# EAGLE design item_2022_Motherboard_02_V7 (EAGLE 7.7.0)

## Sheet 1 of 2
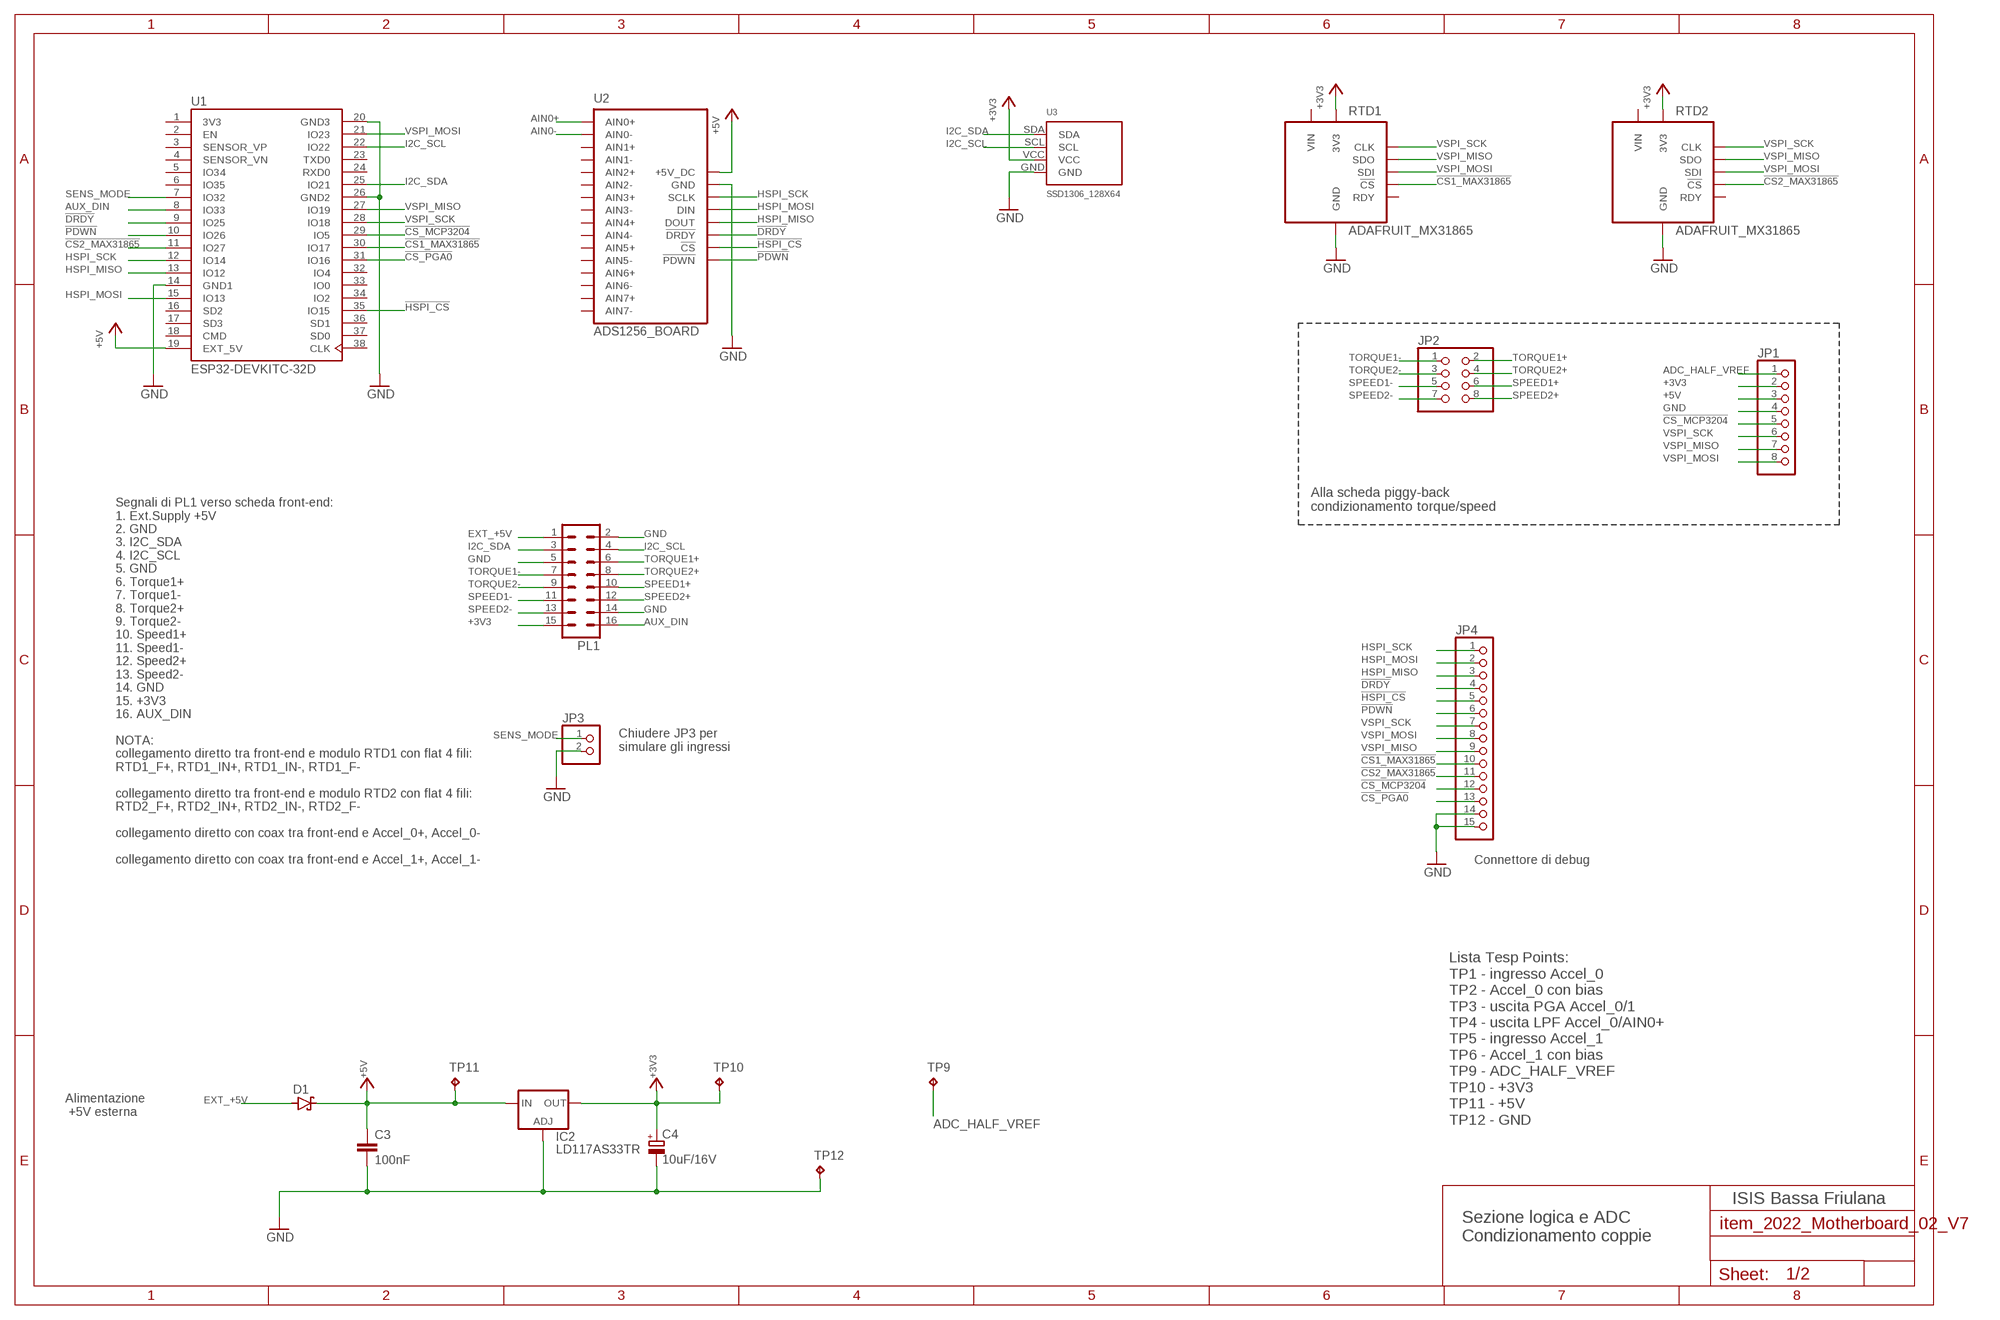
[diagram p0: schematic, sheet 1]

### Parts
C3  100nF  C-EUC0805K  [C0805K]
C4  10uF/16V  CPOL-EUE3.5-8  [E3,5-8]
D1  SCHOTTKY-DIODEDO35-7  [DO35-7]
IC2  LD117AS33TR  [SOT223]
JP1  PINHD-1X8  [1X08]
JP2  PINHD-2X4  [2X04]
JP3  PINHD-1X2  [1X02]
JP4  PINHD-1X15  [1X15]
PL1  16V  [16V]
RTD1  ADAFRUIT_MX31865  [ADAFRUIT_MAX31865]
RTD2  ADAFRUIT_MX31865  [ADAFRUIT_MAX31865]
TP9  TPTP16SQ  [TP16SQ]
TP10  TPTP16SQ  [TP16SQ]
TP11  TPTP16SQ  [TP16SQ]
TP12  TPTP14R  [TP14R]
U1  ESP32-DEVKITC-32D  [MODULE_ESP32-DEVKITC-32D]
U2  ADS1256_BOARD  [ADS1256_BOARD]
U3  SSD1306_128X64  [128X64]

### Nets
!CS1_MAX31865! [digital]: JP4.10 RTD1.P7(!CS!) U1.30(IO17)
!CS2_MAX31865! [digital]: JP4.11 RTD2.P7(!CS!) U1.11(IO27)
!CS_MCP3204! [digital]: JP1.5 JP4.12 U1.29(IO5)
!CS_PGA0! [digital]: JP4.13 U1.31(IO16) ; also sheet 2
!DRDY! [digital]: JP4.4 U1.9(IO25) U2.!DRDY!
!HSPI_CS! [digital]: JP4.5 U1.35(IO15) U2.!CS!
!PDWN! [digital]: JP4.6 U1.10(IO26) U2.PDWN(!PDWN!)
+3V3 [supply]: C4.+ IC2.4(OUT) JP1.2 PL1.15 RTD1.P3(3V3) RTD2.P3(3V3) TP10.TP U3.VCC
+5V [supply]: C3.1 D1.C IC2.3(IN) JP1.3 TP11.TP U1.19(EXT_5V) U2.5V_DC(+5V_DC) ; also sheet 2
ADC_HALF_VREF [supply]: JP1.1 TP9.TP ; also sheet 2
AIN0+ [analog]: U2.AIN0+ ; also sheet 2
AIN0- [analog]: U2.AIN0- ; also sheet 2
AUX_DIN [digital]: PL1.16 U1.8(IO33)
EXT_+5V [supply]: D1.A PL1.1
GND [supply]: C3.2 C4.- IC2.1(ADJ) JP1.4 JP3.2 JP4.14 JP4.15 PL1.2 PL1.5 PL1.14 RTD1.P2(GND) RTD2.P2(GND) TP12.TP U1.14(GND1) U1.20(GND3) U1.26(GND2) U2.GND U3.GND ; also sheet 2
HSPI_MISO [digital]: JP4.3 U1.13(IO12) U2.DOUT
HSPI_MOSI [digital]: JP4.2 U1.15(IO13) U2.DIN
HSPI_SCK [digital]: JP4.1 U1.12(IO14) U2.SCLK
I2C_SCL [digital]: PL1.4 U1.22(IO22) U3.SCL
I2C_SDA [digital]: PL1.3 U1.25(IO21) U3.SDA
SENS_MODE [digital]: JP3.1 U1.7(IO32)
SPEED1+ [analog]: JP2.6 PL1.10
SPEED1- [supply]: JP2.5 PL1.11
SPEED2+ [analog]: JP2.8 PL1.12
SPEED2- [supply]: JP2.7 PL1.13
TORQUE1+ [analog]: JP2.2 PL1.6
TORQUE1- [supply]: JP2.1 PL1.7
TORQUE2+ [analog]: JP2.4 PL1.8
TORQUE2- [supply]: JP2.3 PL1.9
VSPI_MISO [digital]: JP1.7 JP4.9 RTD1.P5(SDO) RTD2.P5(SDO) U1.27(IO19)
VSPI_MOSI [digital]: JP1.8 JP4.8 RTD1.P6(SDI) RTD2.P6(SDI) U1.21(IO23) ; also sheet 2
VSPI_SCK [digital]: JP1.6 JP4.7 RTD1.P4(CLK) RTD2.P4(CLK) U1.28(IO18) ; also sheet 2
Unconnected: RTD1.P8(RDY) RTD2.P8(RDY) U1.2(EN) U1.3(SENSOR_VP) U1.4(SENSOR_VN) U1.5(IO34) U1.6(IO35) U1.16(SD2) U1.17(SD3) U1.18(CMD) U1.23(TXD0) U1.24(RXD0) U1.32(IO4) U1.33(IO0) U1.34(IO2) U1.36(SD1) U1.37(SD0) U1.38(CLK) U2.AIN1+ U2.AIN1- U2.AIN2+ U2.AIN2- U2.AIN3+ U2.AIN3- U2.AIN4+ U2.AIN4- U2.AIN5+ U2.AIN5- U2.AIN6+ U2.AIN6- U2.AIN7+ U2.AIN7-

### Notes on the sheet
- Alla scheda piggy-back
  condizionamento torque/speed
- Chiudere JP3 per
  simulare gli ingressi
- Connettore di debug
- Segnali di PL1 verso scheda front-end:
  1. Ext.Supply +5V
  2. GND
  3. I2C_SDA
  4. I2C_SCL
  5. GND
  6. Torque1+
  7. Torque1-
  8. Torque2+
  9. Torque2-
  10. Speed1+
  11. Speed1-
  12. Speed2+
  13. Speed2-
  14. GND
  15. +3V3
  16. AUX_DIN
  
  NOTA:
  collegamento diretto tra front-end e modulo RTD1 con flat 4 fili:
  RTD1_F+, RTD1_IN+, RTD1_IN-, RTD1_F-
  
  collegamento diretto tra front-end e modulo RTD2 con flat 4 fili:
  RTD2_F+, RTD2_IN+, RTD2_IN-, RTD2_F-
  
  collegamento diretto con coax tra front-end e Accel_0+, Accel_0-
  
  collegamento diretto con coax tra front-end e Accel_1+, Accel_1-
- Alimentazione
   +5V esterna
- Lista Tesp Points:
  TP1 - ingresso Accel_0
  TP2 - Accel_0 con bias
  TP3 - uscita PGA Accel_0/1
  TP4 - uscita LPF Accel_0/AIN0+
  TP5 - ingresso Accel_1
  TP6 - Accel_1 con bias
  TP9 - ADC_HALF_VREF
  TP10 - +3V3
  TP11 - +5V
  TP12 - GND
- ISIS Bassa Friulana
- Sezione logica e ADC
  Condizionamento coppie

## Sheet 2 of 2
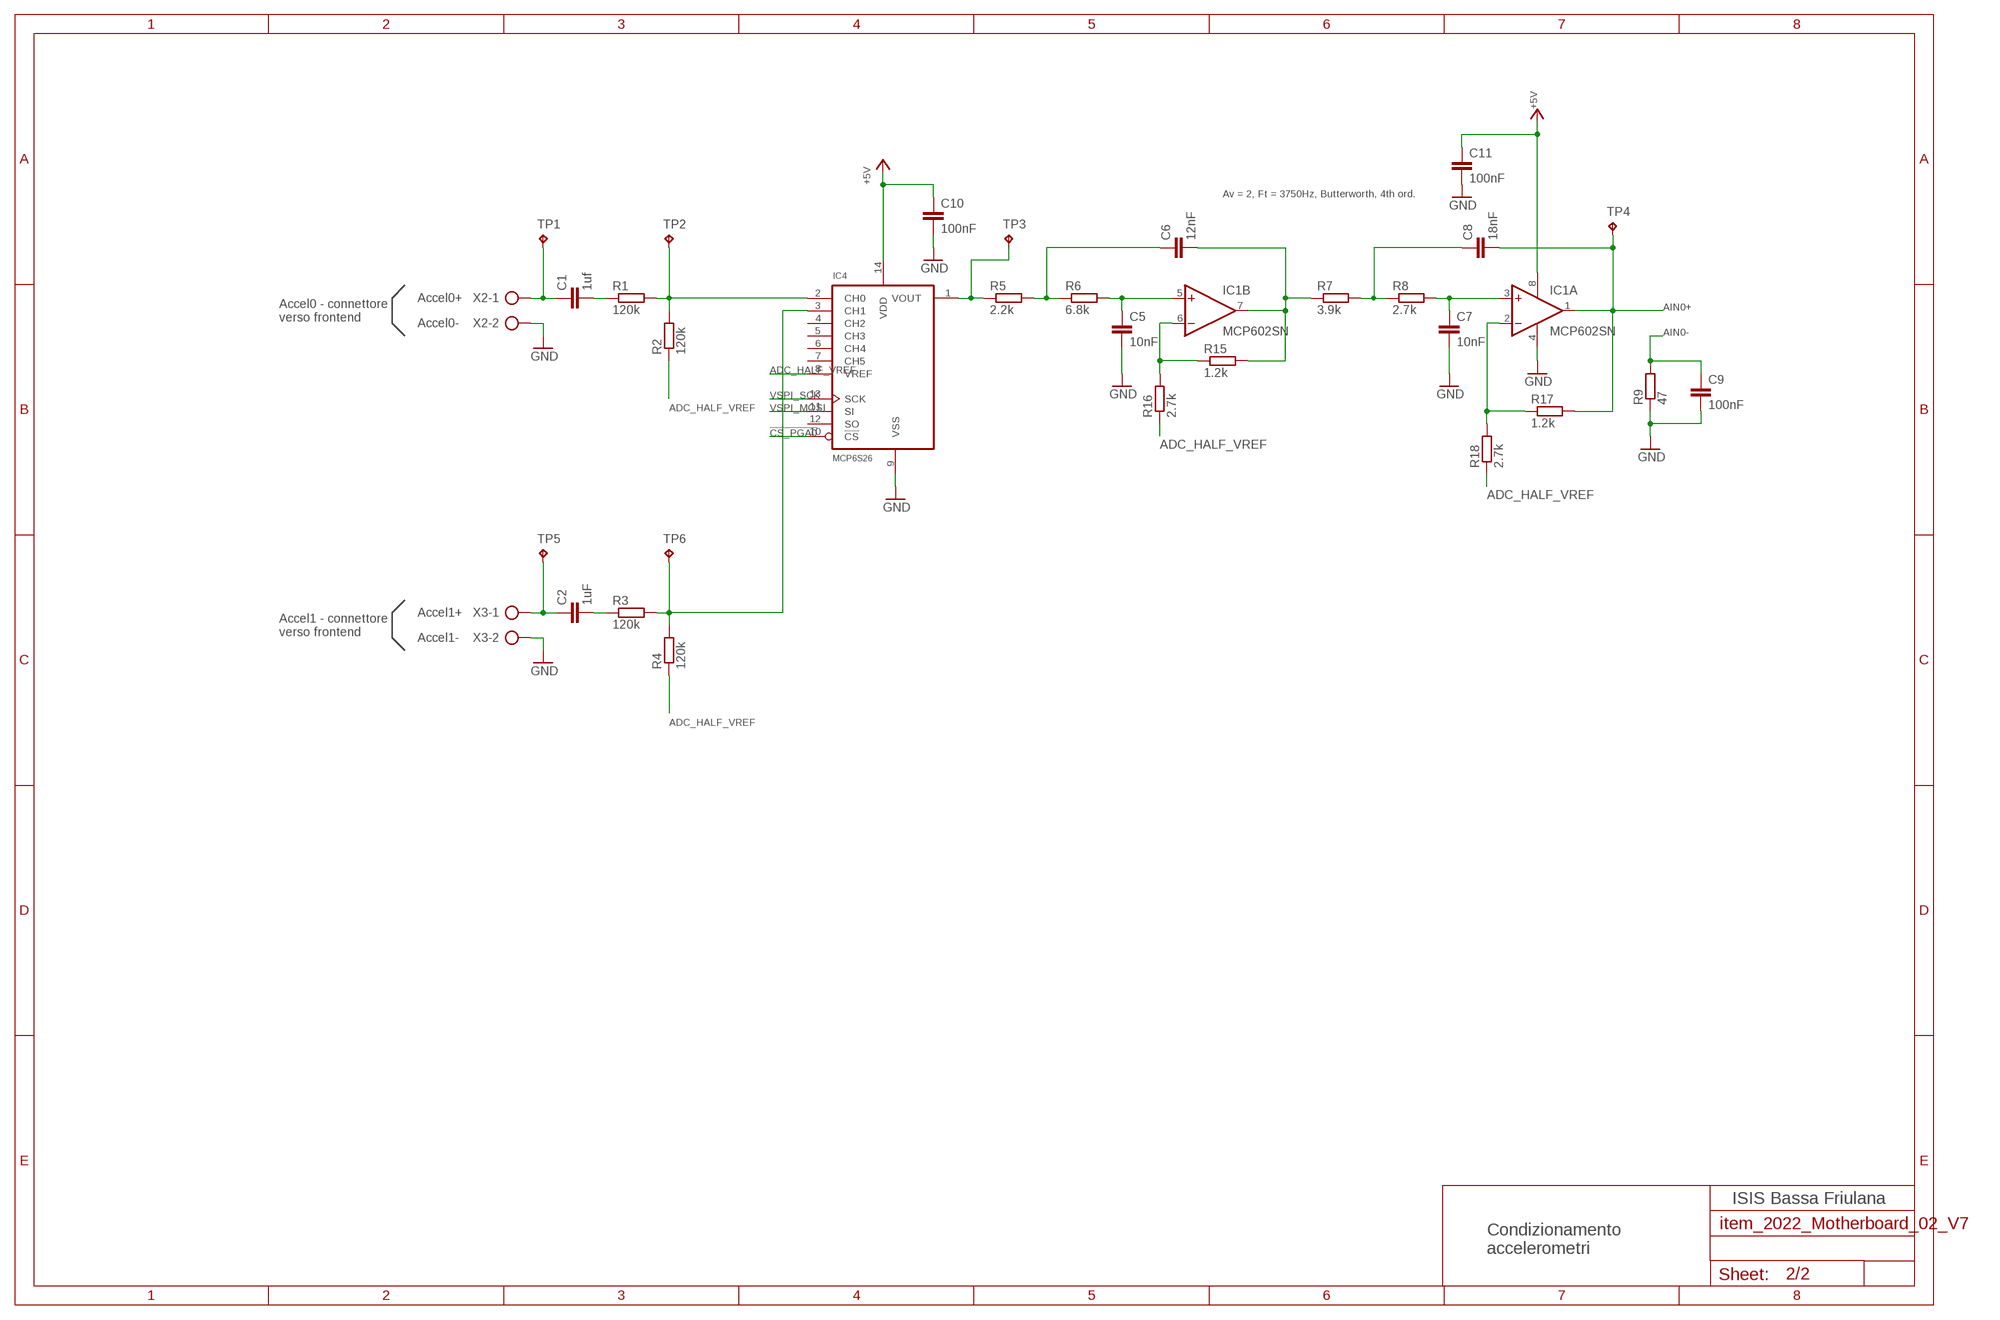
[diagram p1: schematic, sheet 2]

### Parts
C1  1uf  C-EUC1206  [C1206]
C2  1uF  C-EUC1206  [C1206]
C5  10nF  C-EUC0805K  [C0805K]
C6  12nF  C-EUC0805K  [C0805K]
C7  10nF  C-EUC0805K  [C0805K]
C8  18nF  C-EUC0805K  [C0805K]
C9  100nF  C-EUC0805K  [C0805K]
C10  100nF  C-EUC0805K  [C0805K]
C11  100nF  C-EUC0805K  [C0805K]
IC1  MCP602SN  [SO08]
IC4  MCP6S26  [SO14]
R1  120k  R-EU_R0805  [R0805]
R2  120k  R-EU_R0805  [R0805]
R3  120k  R-EU_R0805  [R0805]
R4  120k  R-EU_R0805  [R0805]
R5  2.2k  R-EU_R0805  [R0805]
R6  6.8k  R-EU_R0805  [R0805]
R7  3.9k  R-EU_R0805  [R0805]
R8  2.7k  R-EU_R0805  [R0805]
R9  47  R-EU_R0805  [R0805]
R15  1.2k  R-EU_R0805  [R0805]
R16  2.7k  R-EU_R0805  [R0805]
R17  1.2k  R-EU_R0805  [R0805]
R18  2.7k  R-EU_R0805  [R0805]
TP1  TPTP14R  [TP14R]
TP2  TPTP14R  [TP14R]
TP3  TPTP14R  [TP14R]
TP4  TPTP14R  [TP14R]
TP5  TPTP14R  [TP14R]
TP6  TPTP14R  [TP14R]
X2  AK500/2  [AK500/2]
X3  AK500/2  [AK500/2]

### Nets
!CS_PGA0! [digital]: IC4.10(!CS!) ; also sheet 1
+5V [supply]: C10.1 C11.1 IC1.8(P:V+) IC4.14(VDD) ; also sheet 1
ADC_HALF_VREF [supply]: IC4.8(VREF) R2.1 R4.1 R16.1 R18.1 ; also sheet 1
AIN0+ [analog]: C8.2 IC1.1(A:OUT) R17.2 TP4.TP ; also sheet 1
AIN0- [analog]: C9.1 R9.2 ; also sheet 1
GND [supply]: C5.2 C7.2 C9.2 C10.2 IC1.4(P:V-) IC4.9(VSS) R9.1 X2.2 X3.2 ; also sheet 1
N$2 [analog]: C1.1 TP1.TP X2.1
N$3 [analog]: C2.1 TP5.TP X3.1
N$4 [analog]: IC4.2(CH0) R1.2 R2.2 TP2.TP
N$5 [analog]: IC4.1(VOUT) R5.1 TP3.TP
N$6 [analog]: C1.2 R1.1
N$7: C2.2 R3.1
N$8 [analog]: IC1.6(B:-IN) R15.1 R16.2
N$9 [analog]: C6.1 R5.2 R6.1
N$10 [analog]: C5.1 IC1.5(B:+IN) R6.2
N$11 [analog]: C6.2 IC1.7(B:OUT) R7.1 R15.2
N$12 [analog]: C8.1 R7.2 R8.1
N$13 [analog]: C7.1 IC1.3(A:+IN) R8.2
N$14 [analog]: IC4.3(CH1) R3.2 R4.2 TP6.TP
N$21 [analog]: IC1.2(A:-IN) R17.1 R18.2
VSPI_MOSI [digital]: IC4.11(SI) ; also sheet 1
VSPI_SCK [digital]: IC4.13(SCK) ; also sheet 1
Unconnected: C11.2 IC4.4(CH2) IC4.5(CH3) IC4.6(CH4) IC4.7(CH5) IC4.12(SO)

### Notes on the sheet
- Av = 2, Ft = 3750Hz, Butterworth, 4th ord.
- Accel0+
- Accel0 - connettore 
  verso frontend
- Accel0-
- Accel1+
- Accel1 - connettore 
  verso frontend
- Accel1-
- ISIS Bassa Friulana
- Condizionamento
  accelerometri

## Power pins joined to a net without a drawn wire
3V3: U1.1(3V3)
VIN: RTD1.P1(VIN) RTD2.P1(VIN)

## Library data of the parts
C1-C3 C5-C11 = rcl:C-EU: CAPACITOR, European symbol; SPICEPREFIX: C
C4 = rcl@1:CPOL-EU: POLARIZED CAPACITOR, European symbol
D1 = diode:SCHOTTKY-DIODE: Schottky Diode
IC1 = linear:MCP602: Single Op Amp 2.7V to 6.0V Single Supply CMOS Source: http://ww1.microchip.com/downloads/en/DeviceDoc/21314g.pdf
IC2 = v-reg:LD117A?*: Low drop fixed and adjustable positive voltage regulators 1 A Source: http://www.st.com/stonline/products/literature/ds/7194/ld1117axx.pdf
IC4 = microchip_opamp:MCP6S26: MCP6S26 Six channels analog Programmable Gain Amplifier with SPI interface
JP1 = pinhead:PINHD-1X8: PIN HEADER
JP2 = pinhead:PINHD-2X4: PIN HEADER
JP3 = pinhead:PINHD-1X2: PIN HEADER
JP4 = pinhead:PINHD-1X15: PIN HEADER
PL1 = con-harting-v:16V: CONNECTOR; OC_FARNELL: unknown; OC_NEWARK: unknown
R1-R9 R15-R18 = rcl:R-EU_: RESISTOR, European symbol; SPICEPREFIX: R
RTD1 RTD2 = Adafruit_MAX31865_RTD:ADAFRUIT_MX31865: Adafruit MAX31865 - Adafruit MAX31865 RTD PT100 or PT1000 Amplifier
TP1-TP6 TP9-TP12 = testpad:TP: Test pad
U1 = ESP32-DEVKITC-32D:ESP32-DEVKITC-32D: Eval Board For Esp-Wroom-32 Check prices <https://pricing.snapeda.com/parts/ESP32-DEVKITC-32D/Espressif%20Systems/view-part?ref=eda>; AVAILABILITY: Warning; DESCRIPTION: WiFi Development Tools (802.11) ESP32 General Development Kit, ESP32-WROOM-32D on the board; MF: Espressif Systems; MP: ESP32-DEVKITC-32D; PACKAGE: None; PRICE: None; PURCHASE-URL: https://pricing.snapeda.com/search/part/ESP32-DEVKITC-32D/?ref=eda
U2 = ADS1256:ADS1256_BOARD: Board 8 Channels - ADS1256 24bit
U3 = ssd1306oled:SSD1306_128X64: OLED Display Board 0.91" 128x64 White I2C - 4 Pins - SSD1306
X2 X3 = con-ptr500:AK500/2: CONNECTOR; OC_FARNELL: unknown; OC_NEWARK: unknown

## Net classes
1 supply: width 0.762 mm, drill 0.508 mm, clearance 0.406 mm to class 0, clearance 0.406 mm
2 digital: width 0.305 mm, drill 0.305 mm, clearance 0.305 mm to class 0, clearance 0.305 mm to class 1, clearance 0.305 mm
3 analog: width 0.508 mm, drill 0.508 mm, clearance 0.406 mm to class 0, clearance 0.406 mm to class 1, clearance 0.406 mm to class 2, clearance 0.406 mm

## Board
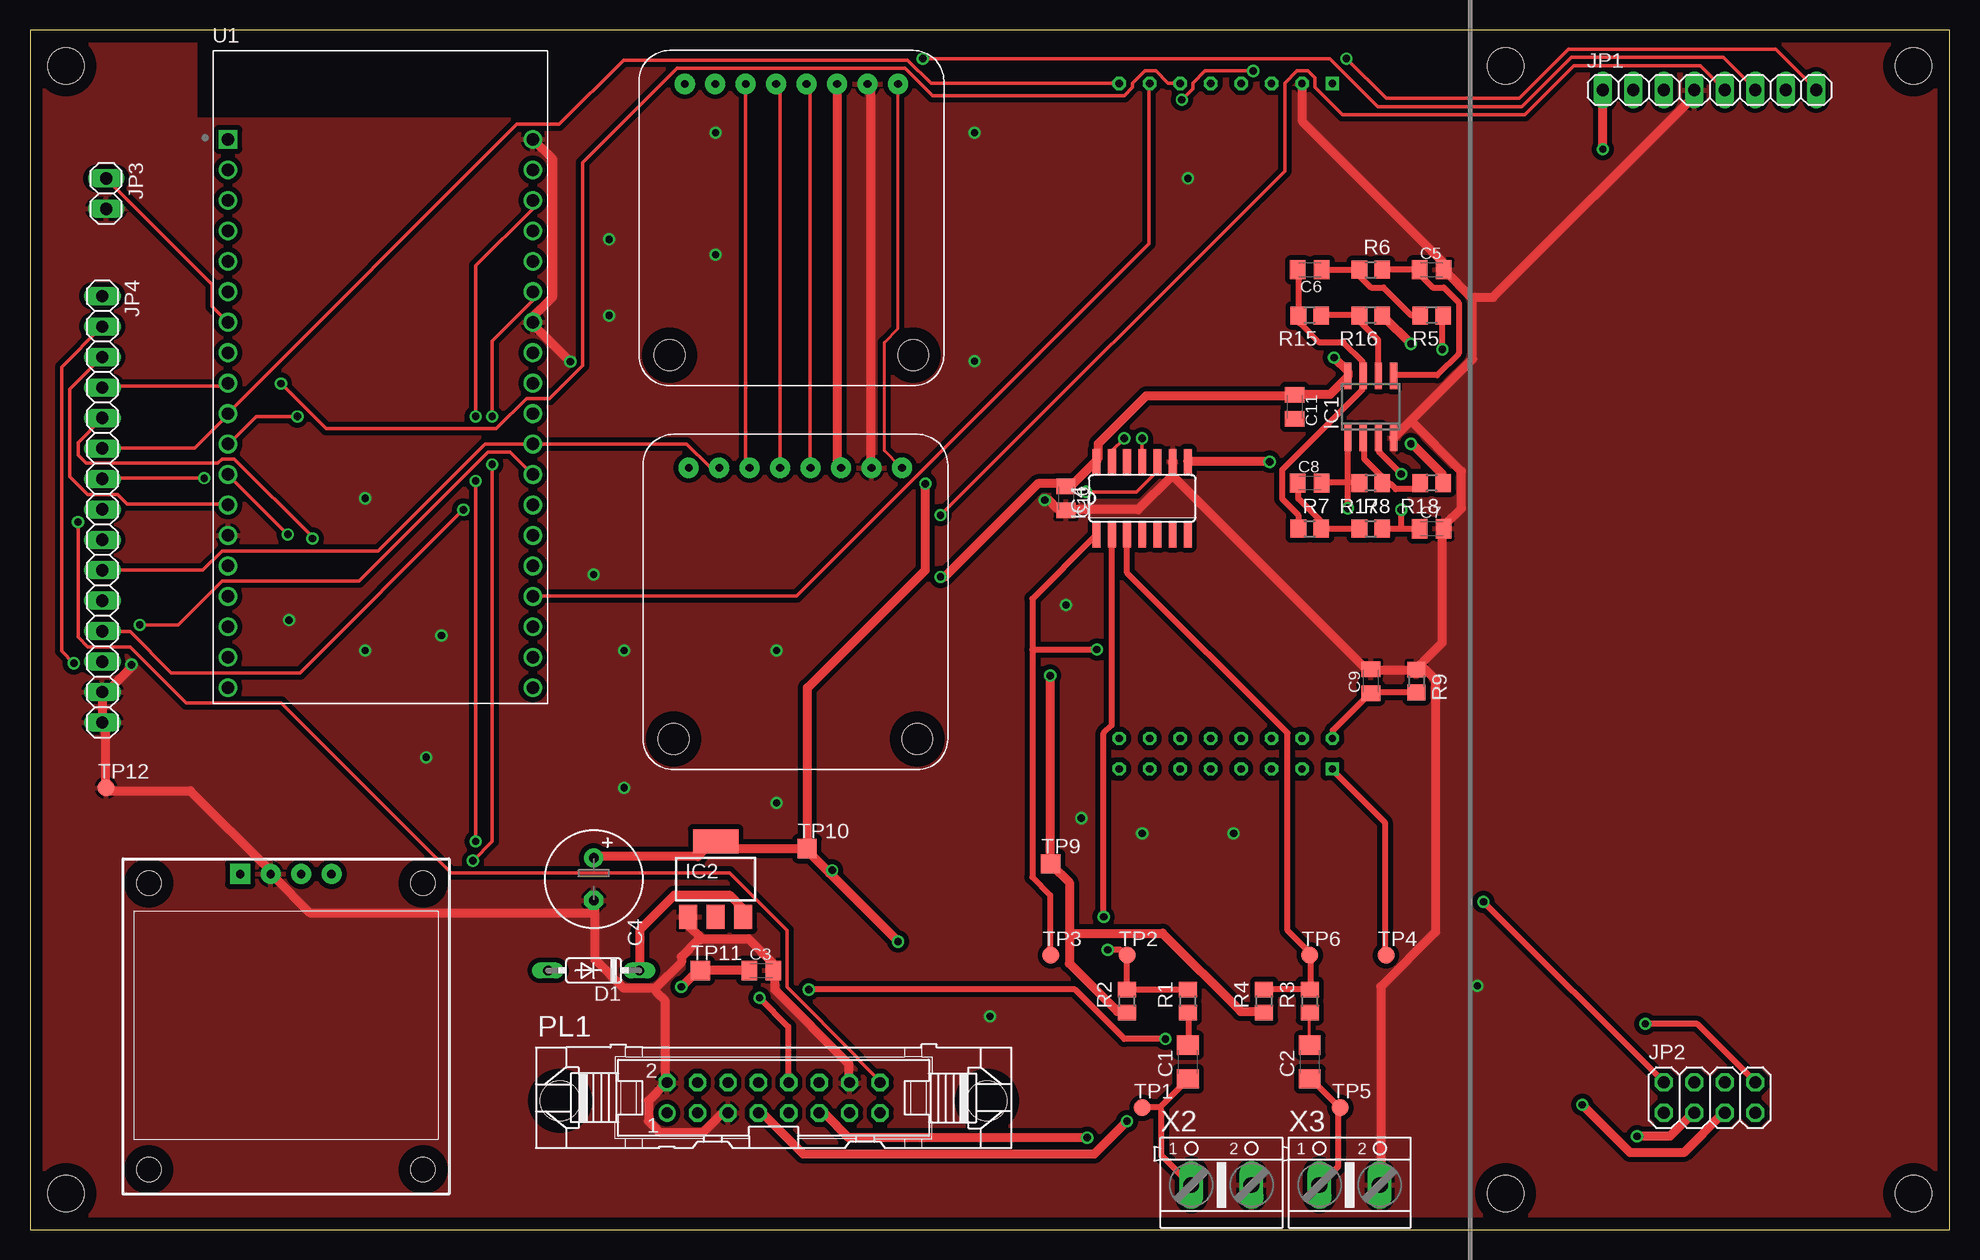
[diagram p2: board, top side]
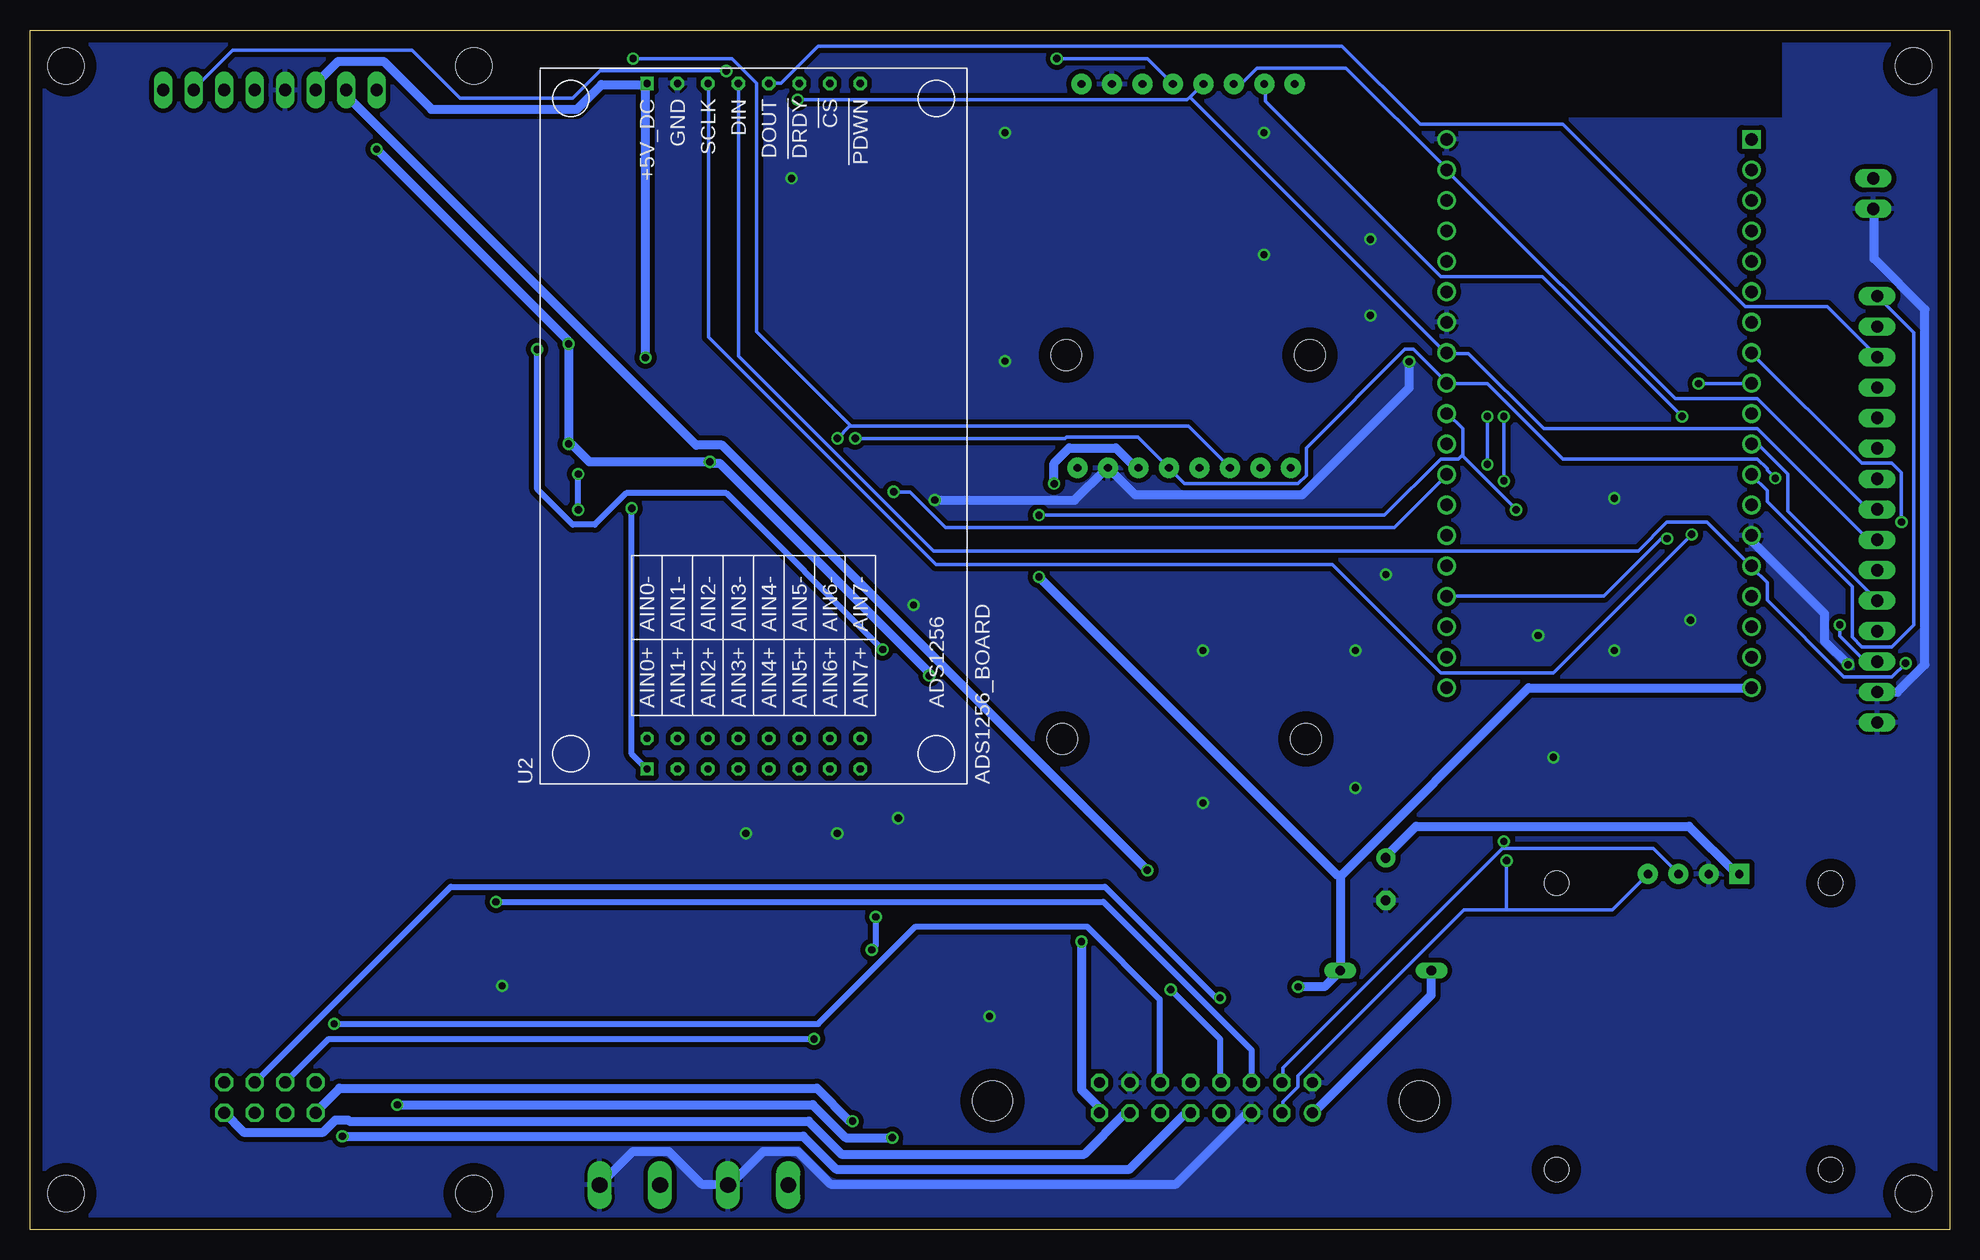
[diagram p3: board, bottom side, seen from below]

Size 160 x 100 mm. Coordinates in mm from the lower left corner, seen from the top.
Outline: 0,0 160,0 160,100 0,100 0,0
Copper layers (1*16): Top 0.035mm / dielectric 1.5mm / Bottom 0.035mm
Design rules "default": minimum track width 10mil, minimum drill 24mil, track to track 8mil, track to pad 8mil, pad to pad 8mil, via to via 8mil, smd to smd 8mil, copper to edge 40mil, drill to drill 8mil, minimum pad ring 10mil, minimum via ring 8mil, stop-mask expansion 4mil, vias tented up to drill 0mil, thermal gap 10mil
Holes 3 mm at 157,97 157,3 123,97 123,3 3,97 3,3
tRestrict: area 14,92.7 to 44.5,100.3
bRestrict: area 14,92.7 to 44.5,100.3

### Footprints (pad centres in the part's own frame; a part is rotated, then mirrored left to right if it is on the bottom)
C1206 = smd 1.6 x 1.8: 1 -1.4,0; 2 1.4,0
C0805K = smd 1.3 x 1.6: 1 -1,0; 2 1,0
E3,5-8 = drill 0.813 pad 1.6: + -1.778,0 | drill 0.813 pad 1.6 octagon: - 1.778,0
DO35-7 = drill 0.813 long: A 3.81,0; C -3.81,0
SO08 = smd 0.6 x 2.2: 1 -1.905,-2.6; 2 -0.635,-2.6; 3 0.635,-2.6; 4 1.905,-2.6; 5 1.905,2.6; 6 0.635,2.6; 7 -0.635,2.6; 8 -1.905,2.6
SOT223 = smd 1.5 x 2: 1 -2.3,-3.15; 2 0,-3.15; 3 2.3,-3.15 | smd 3.8 x 2: 4 0,3.15
SO14 = smd 0.66 x 2.032: 1 -3.81,-3.073; 2 -2.54,-3.073; 3 -1.27,-3.073; 4 0,-3.073; 5 1.27,-3.073; 6 2.54,-3.073; 7 3.81,-3.073; 8 3.81,3.073; 9 2.54,3.073; 10 1.27,3.073; 11 0,3.073; 12 -1.27,3.073; 13 -2.54,3.073; 14 -3.81,3.073
1X08 = drill 1.016 long: 1 -8.89,0; 2 -6.35,0; 3 -3.81,0; 4 -1.27,0; 5 1.27,0; 6 3.81,0; 7 6.35,0; 8 8.89,0
2X04 = drill 1.016 octagon: 1 -3.81,-1.27; 2 -3.81,1.27; 3 -1.27,-1.27; 4 -1.27,1.27; 5 1.27,-1.27; 6 1.27,1.27; 7 3.81,-1.27; 8 3.81,1.27
1X02 = drill 1.016 long: 1 -1.27,0; 2 1.27,0
1X15 = drill 1.016 long: 1 -17.78,0; 2 -15.24,0; 3 -12.7,0; 4 -10.16,0; 5 -7.62,0; 6 -5.08,0; 7 -2.54,0; 8 0,0; 9 2.54,0; 10 5.08,0; 11 7.62,0; 12 10.16,0; 13 12.7,0; 14 15.24,0; 15 17.78,0
16V = drill 0.914: 1 -8.89,-1.27 | drill 0.914 octagon: 2 -8.89,1.27; 3 -6.35,-1.27; 4 -6.35,1.27; 5 -3.81,-1.27; 6 -3.81,1.27; 7 -1.27,-1.27; 8 -1.27,1.27; 9 1.27,-1.27; 10 1.27,1.27; 11 3.81,-1.27; 12 3.81,1.27; 13 6.35,-1.27; 14 6.35,1.27; 15 8.89,-1.27; 16 8.89,1.27 | hole 3.302: 17.78,-0.254; -17.78,-0.254
R0805 = smd 1.3 x 1.5: 1 -0.95,0; 2 0.95,0
ADAFRUIT_MAX31865 = drill 0.65 pad 1.676: P1 -8.89,-10.16; P2 -6.35,-10.16; P3 -3.81,-10.16; P4 -1.27,-10.16; P5 1.27,-10.16; P6 3.81,-10.16; P7 6.35,-10.16; P8 8.89,-10.16 | hole 2.54: -10.16,12.446; 10.16,12.446
TP14R = smd 1.4 x 1.4: TP 0,0
TP16SQ = smd 1.6 x 1.6: TP 0,0
MODULE_ESP32-DEVKITC-32D = drill 1.04 square: 1 -12.7,19.76 | drill 1.04: 2 -12.7,17.22; 3 -12.7,14.68; 4 -12.7,12.14; 5 -12.7,9.6; 6 -12.7,7.06; 7 -12.7,4.52; 8 -12.7,1.98; 9 -12.7,-0.56; 10 -12.7,-3.1; 11 -12.7,-5.64; 12 -12.7,-8.18; 13 -12.7,-10.72; 14 -12.7,-13.26; 15 -12.7,-15.8; 16 -12.7,-18.34; 17 -12.7,-20.88; 18 -12.7,-23.42; 19 -12.7,-25.96; 20 12.7,19.76; 21 12.7,17.22; 22 12.7,14.68; 23 12.7,12.14; 24 12.7,9.6; 25 12.7,7.06; 26 12.7,4.52; 27 12.7,1.98; 28 12.7,-0.56; 29 12.7,-3.1; 30 12.7,-5.64; 31 12.7,-8.18; 32 12.7,-10.72; 33 12.7,-13.26; 34 12.7,-15.8; 35 12.7,-18.34; 36 12.7,-20.88; 37 12.7,-23.42; 38 12.7,-25.96
ADS1256_BOARD = drill 0.6 square: 5V_DC 27.94,7.62; AIN0+ -29.21,7.62 | drill 0.6 octagon: !CS! 27.94,-7.62; !DRDY! 27.94,-5.08; AIN0- -26.67,7.62; AIN1+ -29.21,5.08; AIN1- -26.67,5.08; AIN2+ -29.21,2.54; AIN2- -26.67,2.54; AIN3+ -29.21,0; AIN3- -26.67,0; AIN4+ -29.21,-2.54; AIN4- -26.67,-2.54; AIN5+ -29.21,-5.08; AIN5- -26.67,-5.08; AIN6+ -29.21,-7.62; AIN6- -26.67,-7.62; AIN7+ -29.21,-10.16; AIN7- -26.67,-10.16; DIN 27.94,0; DOUT 27.94,-2.54; GND 27.94,5.08; PDWN 27.94,-10.16; SCLK 27.94,2.54
128X64 = drill 0.7 pad 1.676: GND -1.27,12.7; SCL 1.27,12.7; SDA 3.81,12.7 | drill 0.7 pad 1.676 square: VCC -3.81,12.7 | hole 2.032: -11.43,11.938; -11.43,-11.938; 11.43,11.938; 11.43,-11.938
AK500/2 = drill 1.321 long: 1 -2.515,0; 2 2.515,0

### Placement (x,y rotation side)
C1  96.52,13.97 90 top
C2  106.68,13.97 90 top
C3  60.96,21.59 0 top
C4  46.99,29.21 270 top
C5  116.84,80.01 0 top
C6  106.68,80.01 180 top
C7  116.84,58.42 0 top
C8  106.68,62.23 0 top
C9  111.76,45.72 90 top
C10  86.36,60.96 270 top
C11  105.41,68.58 270 top
D1  46.99,21.59 180 top
IC1  111.76,68.58 0 top
IC2  57.15,29.21 0 top
IC4  92.71,60.96 0 top
JP1  140,95 0 top
JP2  140,11 0 top
JP3  6.35,86.36 270 top
JP4  6.03,60.04 270 top
PL1  61.98,10.98 0 top
R1  96.52,19.05 90 top
R2  91.44,19.05 90 top
R3  106.68,19.05 90 top
R4  102.87,19.05 90 top
R5  116.84,76.2 180 top
R6  111.76,80.01 0 top
R7  106.68,58.42 0 top
R8  111.76,58.42 0 top
R9  115.57,45.72 270 top
R15  106.68,76.2 180 top
R16  111.76,76.2 180 top
R17  111.76,62.23 180 top
R18  116.84,62.23 180 top
RTD1  63.8,53.34 180 top
RTD2  63.47,85.34 180 top
TP1  92.71,10.16 0 top
TP2  91.44,22.86 0 top
TP3  85.09,22.86 0 top
TP4  113.03,22.86 0 top
TP5  109.22,10.16 0 top
TP6  106.68,22.86 0 top
TP9  85.09,30.48 0 top
TP10  64.77,31.75 0 top
TP11  55.88,21.59 0 top
TP12  6.35,36.83 0 top
U1  29.21,71.12 0 top
U2  100.95,67.61 90 bottom
U3  21.33,16.93 0 top
X2  99.31,3.71 0 top
X3  110,3.71 0 top

### Tracks (layer width: path | path; a pad name or v marks a point on that pad's centre or on a via)
!CS1_MAX31865!
  Top 0.305: JP4.10 6.06,54.98 14.4,54.98 16,56.58 29.03,56.58 37.95,65.49 41.83,65.49 U1.30 42.06,65.49 54.75,65.49 56.69,63.55 57.38,63.55 RTD1.P7
!CS2_MAX31865!  (via drill 0.61)
  Top 0.305: v22.29,67.78 18.86,67.78 16.57,65.49 U1.11
  Bottom 0.305: JP4.11 6.06,52.46 13.49,59.89 13.49,62.98 15.89,65.38 16.46,65.38 U1.11 | v22.29,67.78 33.95,79.44 42.41,79.44 57.04,94.07 57.04,95.44 RTD2.P7
!CS_MCP3204!  (via drill 0.61)
  Top 0.305: v36.12,60.01 22.52,46.41 11.77,46.41 8.34,49.84 6.06,49.84 JP4.12 | v75.89,59.55 104.58,88.24 104.58,95.56 105.61,96.58 106.53,96.58 107.1,96.01 107.1,95.21 109.39,92.93 124.59,92.93 128.7,97.04 139.22,97.04 141.16,95.1 JP1.5
  Bottom 0.305: 40.58,64.47 v36.12,60.01 | 40.58,64.47 40.58,66.75 41.83,68.01 U1.29 | v75.89,59.55 47.09,59.55 42.41,64.24 40.92,64.24 40.69,64.47 40.58,64.47
!CS_PGA0!  (via drill 0.61)
  Top 0.305: v88.01,61.49 92.24,61.49 93.95,63.21 93.95,64.01 IC4.10 | v9.14,50.41 12.34,50.41 16,54.06 27.43,54.06 38.18,64.81 40.01,64.81 41.83,62.98 U1.31
  Bottom 0.305: v88.01,61.49 86.64,61.49 83.67,58.52 46.29,58.52 41.95,62.87 U1.31 | v9.14,50.41 9.14,49.49 7.09,47.43 6.06,47.43 JP4.13
!DRDY!  (via drill 0.61)
  Top 0.305: v20.92,70.52 24.69,66.75 38.86,66.75 41.38,69.27 43.32,69.27 46.06,72.01 46.06,88.92 53.95,96.81 72.92,96.81 75.21,94.53 91.21,94.53 91.9,95.21 91.9,95.56 92.93,96.58 93.84,96.58 94.87,95.56 95.78,95.56 U2.!DRDY! | JP4.4 6.06,70.29 16.23,70.29 16.46,70.52 U1.9
  Bottom 0.305: v20.92,70.52 16.57,70.52 U1.9
!HSPI_CS!  (via drill 0.61)
  Top 0.305: U2.!CS! 93.27,95.44 93.27,82.18 63.89,52.81 41.95,52.81 U1.35 | v23.55,57.61 23.55,57.72 17.03,64.24 16,64.24 15.66,63.89 4.69,63.89 4,64.58 4,65.61 5.94,67.55 JP4.5
  Bottom 0.305: v23.55,57.61 24,57.61 28.8,52.81 41.83,52.81 U1.35
!PDWN!
  Top 0.305: U2.PDWN 90.75,95.56 75.09,95.56 73.15,97.5 49.49,97.5 44.12,92.13 40.58,92.13 16.57,68.12 U1.10 16.46,67.89 13.72,65.15 6.06,65.15 JP4.6
+3V3  (via drill 0.61)
  Top 0.762: RTD2.P3 67.32,95.44 67.32,63.78 67.55,63.55 RTD1.P3 | TP10.TP 64.69,31.77 57.72,31.77 57.15,32.35 IC2.4 56.81,32.23 55.66,31.09 47.09,31.09 C4.+ | 66.64,29.72 64.92,31.43 TP10.TP | 66.64,29.72 v72.35,24 | v66.86,29.95 66.64,29.72 | v74.64,62.18 74.64,54.98 64.81,45.15 64.81,32.12 TP10.TP
  Bottom 0.762: v72.35,24 72.35,11.66 70.98,10.29 70.98,9.72 PL1.15 | v66.86,29.95 102.3,65.38 104.47,65.38 133.62,94.53 133.62,94.98 JP1.2 | U3.VCC 17.6,29.72 17.83,29.72 21.72,33.6 44.46,33.6 46.98,31.09 C4.+ | v74.64,62.18 74.64,63.89 73.38,65.15 69.49,65.15 67.89,63.55 67.67,63.55 RTD1.P3
+5V  (via drill 0.61)
  Top 0.762: C3.1 59.89,21.6 55.89,21.6 TP11.TP 55.55,21.49 v54.29,20.23 | IC2.3 59.44,26.06 59.44,26.75 58.29,27.89 53.72,27.89 50.86,25.03 50.86,21.6 D1.C | v108.7,72.69 109.84,71.55 IC1.8 109.84,71.09 108.36,69.61 105.5,69.61 C11.1 105.04,69.49 93.04,69.49 89.04,65.49 89.04,64.35 IC4.14 88.81,64.01 86.87,62.06 86.41,62.06 C10.1 86.07,62.18 84.01,62.18 76.24,54.41 v75.89,54.41
  Bottom 0.762: v54.29,20.23 52.12,20.23 50.86,21.49 D1.C 50.75,21.95 50.75,29.49 | 50.75,29.49 35.09,45.15 16.57,45.15 U1.19 | JP1.3 136.13,95.1 136.13,95.56 134.3,97.38 130.53,97.38 126.53,93.38 114.41,93.38 112.36,95.44 108.58,95.44 U2.5V_DC 108.7,95.1 v108.7,72.69 | v75.89,54.41 51.09,29.6 50.75,29.49
ADC_HALF_VREF  (via drill 0.61)
  Top 0.762: 86.64,24.69 86.64,28.92 85.15,30.4 TP9.TP 85.04,30.86 v85.04,46.18 | 86.64,24.69 86.64,22.17 90.64,18.17 91.44,18.17 R2.1 | 86.64,24.69 94.41,24.69 100.93,18.17 102.87,18.17 R4.1 | v115.1,65.49 115.21,65.49 117.73,62.98 117.73,62.29 R18.1 | v115.1,73.84 112.81,76.12 R16.1 | v103.33,64.01 96.58,64.01 IC4.8 | v131.1,90.07 131.1,94.98 JP1.1
  Bottom 0.762: v131.1,90.07 115.21,74.18 v115.1,73.84 v115.1,65.49 114.76,65.38 113.39,64.01 v103.33,64.01 102.98,63.89 102.53,63.89 85.04,46.41 v85.04,46.18
AIN0+  (via drill 0.61)
  Top 0.508: 109.84,62.29 107.78,62.29 C8.2 | 109.84,62.29 110.76,62.29 R17.2 | 109.84,62.29 109.84,65.95 IC1.1 | TP4.TP 112.93,22.86 112.93,33.95 108.58,38.29 U2.AIN0+ | v109.84,60.12 109.84,62.29
  Bottom 0.508: v109.84,60.12 109.84,39.66 108.58,38.41 U2.AIN0+
AIN0-
  Top 0.508: R9.2 115.56,44.81 111.78,44.81 C9.1 111.56,44.58 108.58,41.6 108.58,41.03 U2.AIN0-
AUX_DIN  (via drill 0.61)
  Top 0.305: v4,58.98 4,49.38 4.8,48.58 8.34,48.58 13.03,43.89 20.92,43.89 35.09,29.72 58.29,29.72 63.09,24.92 63.09,20.23 69.04,14.29 69.04,14.17 70.87,12.34 PL1.16
  Bottom 0.305: v4,58.98 4,63.09 4.8,63.89 7.32,63.89 16.46,73.04 U1.8
EXT_+5V
  Bottom 0.762: D1.A 43.2,21.49 43.2,19.55 53.03,9.72 PL1.1
GND  (via drill 0.6, 0.61)
  Top 0.762: PL1.5 58.06,9.6 57.61,9.6 56.12,8.12 52.46,8.12 51.55,9.03 51.55,10.74 53.03,12.23 PL1.2 52.92,12.57 52.92,19.09 52.23,19.77 52.12,20.12 | 56.01,24.23 59.89,24.23 61.95,22.17 61.95,21.6 C3.2 62.06,21.26 62.06,20 68.24,13.83 68.24,12.34 PL1.14 | 56.01,24.23 54.86,25.38 54.86,25.95 IC2.1 | 47.09,26.4 47.09,22.52 49.49,20.12 52.12,20.12 | 47.09,26.4 47.09,27.43 C4.- | 52.12,20.12 54.29,22.29 54.29,22.75 55.66,24.12 56.01,24.23 | v8.46,47.09 8.46,46.86 6.4,44.81 JP4.14 6.06,44.69 6.06,42.63 JP4.15 6.06,42.18 6.29,41.95 6.29,36.92 TP12.TP 6.63,36.58 13.37,36.58 20,29.95 20,29.72 U3.GND 20.34,29.38 23.32,26.4 47.09,26.4 | U1.20 41.95,90.87 43.55,89.27 43.55,77.72 41.95,76.12 41.95,75.67 U1.26 42.06,75.32 v45.03,72.35 | RTD1.P2 70.07,63.55 70.07,95.21 69.84,95.44 RTD2.P2 | 120.24,77.61 C5.2 117.73,80.35 117.73,80.7 106.07,92.35 106.07,95.44 U2.GND | 120.24,77.61 120.24,72.58 115.1,67.44 | 115.1,67.44 113.73,66.06 IC1.4 | JP1.4 138.65,94.98 138.65,94.41 121.96,77.72 120.59,77.72 120.24,77.61 | 95.21,62.87 92.35,60.01 86.41,60.01 C10.2 86.07,60.12 85.61,60.12 84.92,60.81 v84.58,60.81 | 95.21,62.87 95.21,64.01 IC4.9 | R9.1 115.56,46.63 111.78,46.63 C9.2 111.44,46.63 95.21,62.87 | R9.1 115.79,46.98 117.73,48.92 117.73,58.41 C7.2 117.96,58.75 119.33,60.12 119.33,63.21 115.1,67.44 | X3.2 112.58,3.77 112.58,20.23 117.16,24.8 117.16,45.83 116.13,46.86 R9.1
  Bottom 0.762: JP3.2 6.29,85.04 6.29,80.92 2.06,76.69 2.06,47.09 4.34,44.81 5.94,44.81 JP4.14 | v8.46,47.09 10.4,49.03 10.4,51.32 16.46,57.38 16.46,57.84 U1.14 | v45.03,72.35 45.03,70.18 53.95,61.27 67.89,61.27 70.07,63.44 RTD1.P2 70.41,63.32 72.92,60.81 v84.58,60.81 | X3.2 112.47,3.77 109.73,6.51 106.76,6.51 104.01,3.77 101.84,3.77 X2.2 101.5,3.89 98.87,6.51 96.01,6.51 93.27,3.77 64.47,3.77 58.64,9.6 58.18,9.6 PL1.5
  other vias: 48.26,82.55 57.15,91.44 48.26,76.2 57.15,81.28 78.74,91.44 78.74,72.39 96.52,87.63 27.94,60.96 46.99,54.61 62.23,35.56 33.02,39.37 100.33,33.02 92.71,33.02 86.36,52.07 87.63,34.29 27.94,48.26 34.29,49.53 49.53,36.83 49.53,48.26 62.23,48.26 21.59,50.8 80.01,17.78 120.65,20.32
  pour Top: -1.27,101.6 161.29,101.6 161.29,-2.54 -1.27,-2.54
  pour Bottom: -1.27,101.6 161.29,101.6 161.29,-1.27 -1.27,-1.27
HSPI_MISO
  Top 0.305: U1.13 16.46,60.47 8.12,60.47 7.32,61.27 4.8,61.27 3.31,62.75 3.31,70.07 5.94,72.69 JP4.3
  Bottom 0.305: U2.DOUT 98.3,95.56 97.38,95.56 94.3,98.64 50.63,98.64 44.12,92.13 32.23,92.13 17.03,76.92 10.17,76.92 6.06,72.81 JP4.3
HSPI_MOSI  (via drill 0.61)
  Top 0.305: v3.66,47.21 2.63,48.23 2.63,71.89 5.94,75.21 JP4.2
  Bottom 0.305: U2.DIN 100.93,95.44 100.93,72.81 84.7,56.58 25.95,56.58 23.55,58.98 20.23,58.98 16.57,55.32 U1.15 16.46,55.21 15.2,53.95 15.2,52.46 8.8,46.06 4.8,46.06 v3.66,47.21
HSPI_SCK  (via drill 0.61)
  Top 0.305: v21.49,57.95 16.57,62.87 U1.12
  Bottom 0.305: v21.49,57.95 33.03,46.41 42.41,46.41 51.44,55.44 84.47,55.44 103.44,74.41 103.44,95.44 U2.SCLK | JP4.1 5.94,77.72 2.97,74.75 2.97,50.41 4.8,48.58 7.32,48.58 8.12,49.38 8.12,53.61 15.2,60.69 15.2,61.61 16.46,62.87 U1.12
I2C_SCL  (via drill 0.61)
  Top 0.305: v37.15,67.78 37.15,80.35 41.83,85.04 41.83,85.72 U1.22 | v37.15,32.35 v37.15,62.41
  Bottom 0.305: 37.15,31.77 24.69,31.77 22.63,29.72 U3.SCL | 37.15,31.77 37.26,31.77 55.55,13.49 55.55,12.34 PL1.4 | v37.15,62.41 v37.15,67.78 | 37.15,31.77 v37.15,32.35
I2C_SDA  (via drill 0.61)
  Top 0.305: v38.52,67.78 38.52,74.07 41.83,77.38 41.83,78.07 U1.25 | v38.52,63.78 38.52,32.35 v36.92,30.75
  Bottom 0.305: 36.92,26.63 28.12,26.63 25.15,29.6 U3.SDA | 36.92,26.63 40.46,26.63 54.29,12.8 54.29,11.89 55.55,10.63 55.55,9.72 PL1.3 | v38.52,63.78 v38.52,67.78 | 36.92,26.63 v36.92,30.75
N$2
  Top 0.508: 94.18,10.17 92.81,10.17 TP1.TP | 94.18,10.17 96.47,12.46 C1.1 | 94.18,10.17 94.3,9.94 94.3,6.17 96.7,3.77 X2.1
N$3
  Top 0.508: C2.1 106.76,12.57 109.16,10.17 TP5.TP 109.04,9.94 109.04,5.26 107.56,3.77 X3.1
N$4  (via drill 0.61)
  Top 0.508: R1.2 96.47,20 91.67,20 R2.2 TP2.TP 91.21,22.97 90.87,23.32 v89.84,23.32 | v89.5,26.06 89.5,41.38 90.18,42.06 90.18,57.84 IC4.2
  Bottom 0.508: v89.5,26.06 89.5,23.66 v89.84,23.32
N$5  (via drill 0.61)
  Top 0.508: 83.55,48.35 83.55,52.58 88.81,57.84 IC4.1 | 83.55,48.35 83.55,29.38 85.04,27.89 85.04,22.86 TP3.TP | v117.73,73.38 117.73,76.12 R5.1 | 83.55,48.35 v88.92,48.35
  Bottom 0.508: v117.73,73.38 117.73,61.72 114.76,58.75 112.93,58.75 110.3,61.38 101.96,61.38 v88.92,48.35
N$6
  Top 0.508: R1.1 96.58,18.06 96.58,15.43 C1.2
N$7
  Top 0.254: R3.1 106.64,18.06 106.64,15.43 C2.2
N$8
  Top 0.508: R15.1 107.67,76.24 110.76,76.24 R16.2 110.98,76.01 110.98,75.55 112.36,74.18 112.36,71.21 IC1.6
N$9
  Top 0.508: C6.1 R6.1 110.87,79.78 110.87,79.44 111.78,78.52 112.81,78.52 115.1,76.24 115.79,76.24 R5.2
N$10
  Top 0.508: R6.2 C5.1 115.67,79.78 116.93,78.52 117.84,78.52 119.1,77.27 119.1,73.04 117.27,71.21 113.73,71.21 IC1.5
N$11
  Top 0.508: C6.2 105.73,80.01 105.73,76.24 R15.2 105.84,76.01 105.84,75.55 107.44,73.95 109.5,73.95 111.1,72.35 111.1,71.44 IC1.7 111.1,71.09 111.1,70.07 104.36,63.32 104.36,60.92 105.73,59.55 105.73,58.52 R7.1
N$12
  Top 0.508: R8.1 110.76,58.41 107.67,58.41 R7.2 107.56,58.64 107.56,59.09 105.73,60.92 105.73,62.18 C8.1
N$13  (via drill 0.61)
  Top 0.508: 114.3,58.41 115.79,58.41 C7.1 | 114.3,58.41 112.81,58.41 R8.2 | v114.3,62.98 112.47,64.81 112.47,65.95 IC1.3 | 114.3,58.41 v114.3,60.01
  Bottom 0.508: v114.3,60.01 v114.3,62.98
N$14
  Top 0.508: R4.2 106.53,20 R3.2 106.76,20 106.76,22.86 TP6.TP 106.64,23.09 104.81,24.92 104.81,41.38 91.44,54.75 IC4.3
N$21
  Top 0.508: R18.2 115.79,62.18 115.33,61.72 113.84,61.72 113.39,62.18 112.81,62.18 R17.1 112.58,62.41 112.58,62.87 111.21,64.24 111.21,65.95 IC1.2
SENS_MODE
  Top 0.305: JP3.1 6.4,87.55 15.2,78.75 15.2,76.92 16.46,75.67 U1.7
SPEED1+  (via drill 0.61)
  Top 0.508: v60.81,19.32 63.21,16.92 63.21,12.34 PL1.10
  Bottom 0.508: v60.81,19.32 61.15,19.32 70.41,28.57 124.93,28.57 141.16,12.34 JP2.6
SPEED1-  (via drill 0.61)
  Top 0.762: v88.12,7.66 68.24,7.66 66.29,9.6 65.84,9.6 PL1.11 | v129.39,10.4 133.39,6.4 137.85,6.4 141.16,9.72 JP2.5
  Bottom 0.762: v88.12,7.66 92.01,7.66 94.75,10.4 v129.39,10.4
SPEED2+  (via drill 0.61)
  Top 0.508: v134.65,17.14 138.99,17.14 143.79,12.34 JP2.8
  Bottom 0.508: v134.65,17.14 94.3,17.14 86.18,25.26 71.89,25.26 65.84,19.2 65.84,12.34 PL1.12
SPEED2-
  Bottom 0.762: PL1.13 68.35,9.6 68.81,9.6 72.12,6.29 92.35,6.29 95.1,9.03 133.39,9.03 133.5,9.14 134.53,9.14 135.56,8.12 142.19,8.12 143.79,9.72 JP2.7
TORQUE1+  (via drill 0.61)
  Top 0.508: v121.16,27.32 136.13,12.34 JP2.2
  Bottom 0.508: v121.16,27.32 70.52,27.32 58.18,14.97 58.18,12.34 PL1.6
TORQUE1-  (via drill 0.61)
  Top 0.762: v91.44,9.03 88.7,6.29 64.47,6.29 61.15,9.6 60.81,9.6 PL1.7
  Bottom 0.762: v91.44,9.03 91.67,9.03 94.41,11.77 134.19,11.77 136.13,9.83 JP2.1
TORQUE2+  (via drill 0.61)
  Top 0.508: v64.92,20 87.1,20 91.21,15.89 v94.64,15.89
  Bottom 0.508: v64.92,20 60.81,15.89 60.81,12.34 PL1.8 | v94.64,15.89 135.1,15.89 138.65,12.34 JP2.4
TORQUE2-  (via drill 0.61)
  Top 0.762: v133.96,7.77 136.7,7.77 138.65,9.72 JP2.3
  Bottom 0.762: v133.96,7.77 95.56,7.77 92.81,5.03 68.35,5.03 63.78,9.6 63.32,9.6 PL1.9
VIN
  Top 0.254: RTD2.P1 72.35,95.44 72.35,75.09 71.21,73.95 71.21,64.92 72.58,63.55 RTD1.P1
VSPI_MISO  (via drill 0.61)
  Top 0.305: v101.96,96.58 97.95,96.58 96.93,95.56 96.93,95.1 v96.01,94.18 | RTD1.P5 62.52,63.55 62.52,95.21 62.29,95.44 RTD2.P5
  Bottom 0.305: JP4.9 6.06,57.61 6.86,57.61 16,66.75 33.83,66.75 40.12,73.04 41.83,73.04 U1.27 42.06,73.15 63.32,94.41 | v101.96,96.58 112.47,96.58 114.76,94.3 124.13,94.3 128.13,98.3 143.1,98.3 146.3,95.1 JP1.7 | v96.01,94.18 63.55,94.18 63.32,94.41 | 63.32,94.41 62.29,95.44 RTD2.P5
VSPI_MOSI  (via drill 0.61)
  Top 0.305: v92.7,65.95 92.7,64.12 IC4.11 | v109.73,97.61 113.04,94.3 124.13,94.3 128.25,98.41 145.5,98.41 148.82,95.1 JP1.8 | RTD2.P6 59.66,95.44 59.66,63.78 59.89,63.55 RTD1.P6
  Bottom 0.305: JP4.8 6.06,60.12 6.86,60.12 16,69.27 22.86,69.27 41.83,88.24 U1.21 41.95,88.47 50.29,96.81 57.72,96.81 58.98,95.56 59.55,95.56 RTD2.P6 | 91.67,66.98 v92.7,65.95 | 91.67,66.98 63.44,66.98 60.01,63.55 RTD1.P6 | v109.73,97.61 101.5,97.61 99.44,95.56 99.44,74.87 91.67,67.09 91.67,66.98
VSPI_SCK  (via drill 0.61)
  Top 0.305: v14.52,62.64 6.06,62.64 JP4.7 | v91.21,65.95 90.18,64.92 90.18,64.12 IC4.13 | v74.41,97.61 108.36,97.61 112.36,93.61 124.36,93.61 128.47,97.73 141.16,97.73 143.79,95.1 JP1.6 | RTD1.P4 65.04,63.55 65.04,95.21 64.81,95.44 RTD2.P4
  Bottom 0.305: v14.52,62.64 15.2,63.32 15.2,63.44 16,64.24 32.23,64.24 38.52,70.52 41.83,70.52 U1.28 41.95,70.64 44.69,73.38 45.38,73.38 53.61,65.15 53.61,62.87 54.29,62.18 63.78,62.18 65.04,63.44 RTD1.P4 65.15,63.55 67.67,66.06 73.61,66.06 73.72,65.95 v91.21,65.95 | v74.41,97.61 66.86,97.61 64.81,95.56 RTD2.P4